# EAGLE design Circuit Diagram (EAGLE 9.3.0)
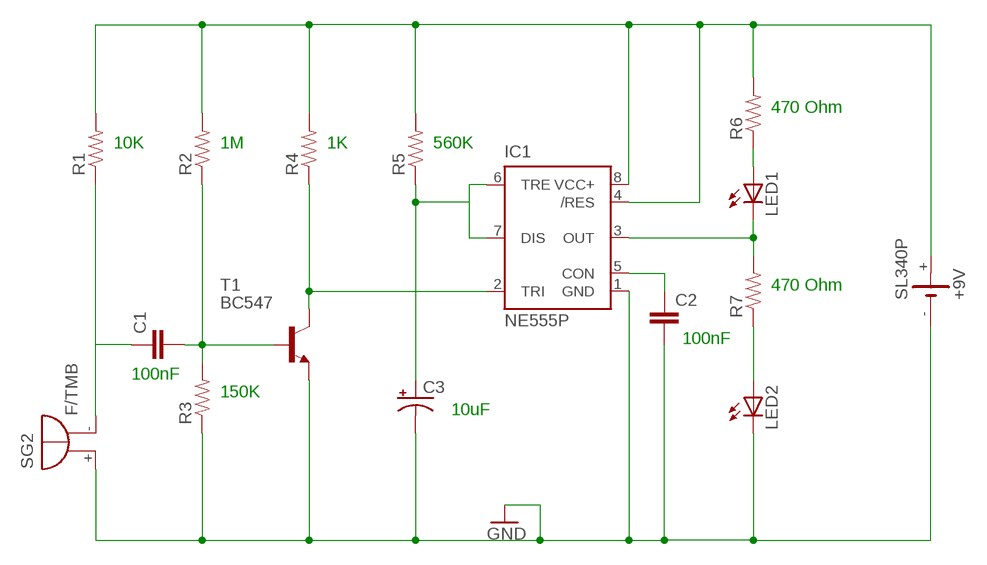
[diagram p0: schematic, sheet 1]

## Parts
+9V  SL340P  [SL-340/P3.6V]
C1  0.1UF-50V-20%(PTH)KIT-EZ  [CAP-PTH-SMALL-KIT]
C2  0.1UF-50V-20%(PTH)KIT-EZ  [CAP-PTH-SMALL-KIT]
C3  CAP_POLPTH1  [CPOL-RADIAL-100UF-25V]
IC1  NE555P  [DIL-08]
LED1  LED5MM  [LED5MM]
LED2  LED5MM  [LED5MM]
R1  10KOHM1/6W5%(PTH)KIT  [AXIAL-0.3-KIT]
R2  10KOHM1/6W5%(PTH)KIT  [AXIAL-0.3-KIT]
R3  10KOHM1/6W5%(PTH)KIT  [AXIAL-0.3-KIT]
R4  10KOHM1/6W5%(PTH)KIT  [AXIAL-0.3-KIT]
R5  10KOHM1/6W5%(PTH)KIT  [AXIAL-0.3-KIT]
R6  10KOHM1/6W5%(PTH)KIT  [AXIAL-0.3-KIT]
R7  10KOHM1/6W5%(PTH)KIT  [AXIAL-0.3-KIT]
SG2  F/TMB  [F/TMB]
T1  BC547  [TO92]

## Nets
GND: +9V.- C2.2 C3.2(-) IC1.1(GND) LED2.K(C) R3.P$1 SG2.+ T1.1(E)
N$1: C1.1 R1.P$1 SG2.-
N$2: C1.2 R2.P$1 R3.P$2 T1.2(B)
N$3: IC1.2(TRI) R4.P$1 T1.3(C)
N$4: C3.1(+) IC1.6(TRE) IC1.7(DIS) R5.P$1
N$5: C2.1 IC1.5(CON)
N$6: IC1.3(OUT) LED1.K(C) R7.P$2
N$7: LED2.A R7.P$1
N$8: +9V.+ IC1.4(/RES) IC1.8(VCC+) R1.P$2 R2.P$2 R4.P$2 R5.P$2 R6.P$2
N$9: LED1.A R6.P$1

## Notes on the sheet
- 470 Ohm
- 10K | 1M | 1K | 560K
- 470 Ohm
- 100nF
- 100nF
- 150K
- 10uF

## Library data of the parts
+9V = battery:SL340P: LI BATTERY Sonnenschein SL-340 P 3.6 V
C1 C2 = SparkFun-Capacitors:0.1UF-50V-20%(PTH): CAP-08370; PROD_ID: CAP-08370
C3 = SparkFun-Capacitors:CAP_POL: Capacitor Polarized These are standard SMD and PTH capacitors. Normally 10uF, 47uF, and 100uF in electrolytic and tantalum varieties. Always verify the external diameter of the through hole cap, it varies with capacity, voltage, and manufacturer. The EIA devices should be standard.
IC1 = SparkFun-AnalogIC:NE555: General purpose bipolar Timer; MF: Arrow Electronics; MPN: NE555N; OC_FARNELL: 1467742; OC_NEWARK: 89K1486
LED1 LED2 = SparkFun-LED:LED: LEDs Standard schematic elements and footprints for 5mm, 3mm, 1206, and 0603 sized LEDs. 5mm - Spark Fun Electronics SKU : COM-00529 (and others)
R1-R7 = SparkFun-Resistors:10KOHM1/6W5%(PTH): RES-08375; PROD_ID: RES-08375
SG2 = buzzer:F/TMB: BUZZER Source: Buerklin; OC_FARNELL: unknown; OC_NEWARK: unknown
T1 = transistor:BC547: NPN TRANSISTOR

## Board
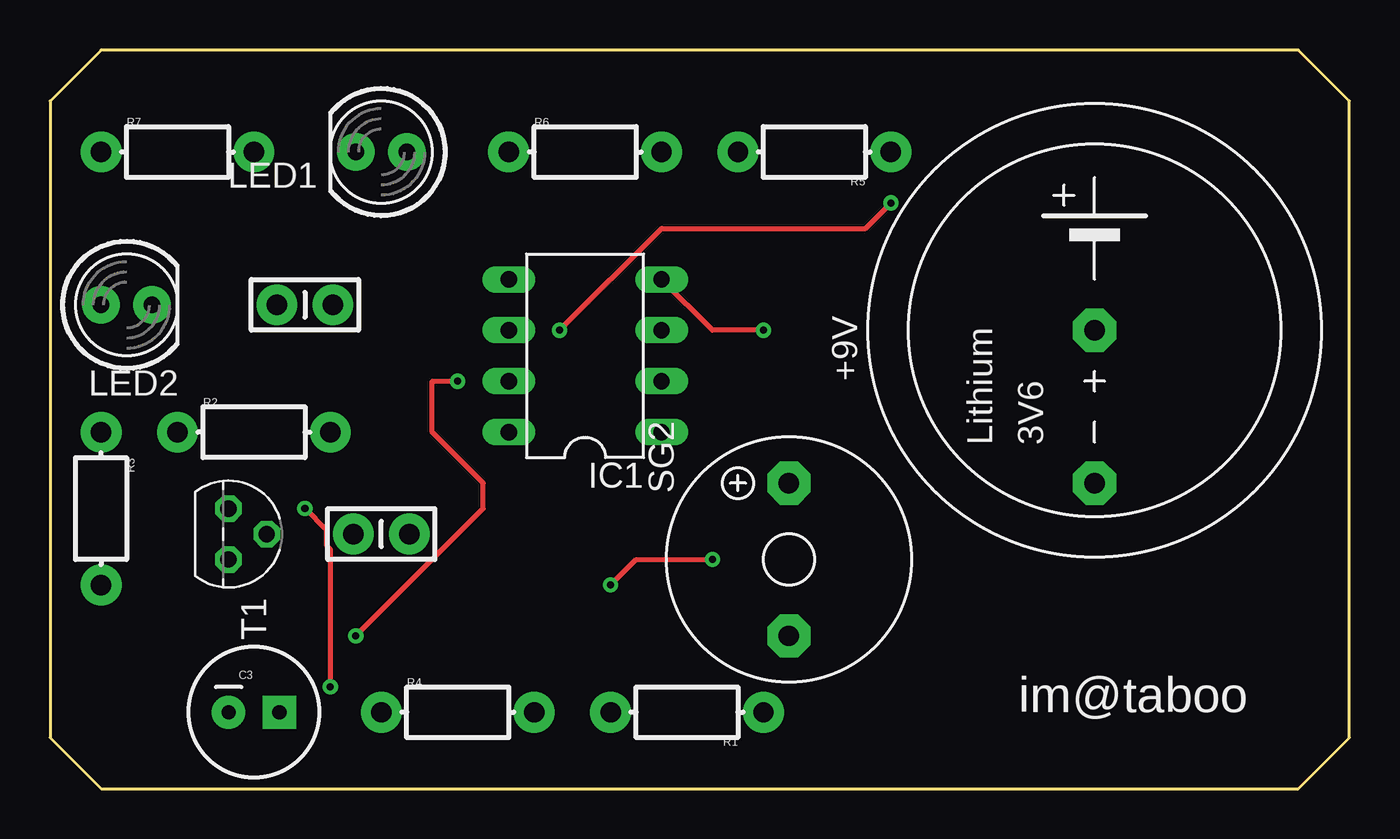
[diagram p1: board, top side]
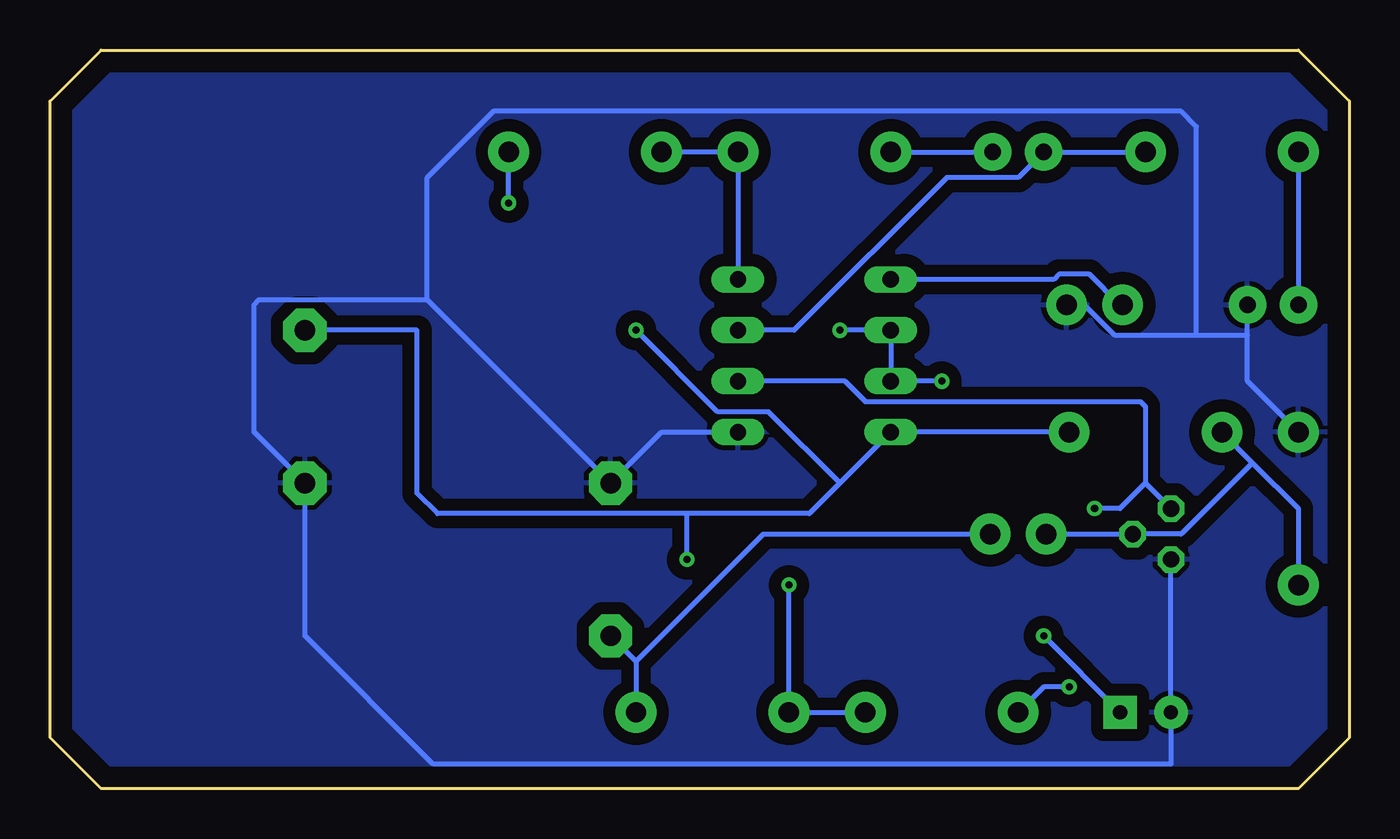
[diagram p2: board, bottom side, seen from below]

Size 64.77 x 36.83 mm. Coordinates in mm from the lower left corner, seen from the top.
Outline: 0,34.29 0,2.54 2.54,0 62.23,0 64.77,2.54 64.77,34.29 62.23,36.83 2.54,36.83 0,34.29
Copper layers (1*16): Top 0.035mm / dielectric 1.5mm / Bottom 0.035mm
Design rules "default *": minimum track width 10mil, minimum drill 0.35mm, track to track 10mil, track to pad 8mil, pad to pad 6mil, via to via 6mil, smd to smd 6mil, copper to edge 40mil, drill to drill 6mil, minimum pad ring 10mil, minimum via ring 8mil, stop-mask expansion 4mil, vias tented up to drill 0mil, thermal gap 10mil

### Footprints (pad centres in the part's own frame; a part is rotated, then mirrored left to right if it is on the bottom)
SL-340/P3.6V = drill 1.016 pad 2.159 octagon: + 0,0; - -7.62,0
CAP-PTH-SMALL-KIT = drill 1.016 pad 2.032: 1 -1.397,0; 2 1.397,0
CPOL-RADIAL-100UF-25V = drill 0.7 pad 1.651 square: 1 1.27,0 | drill 0.7 pad 1.651: 2 -1.27,0
DIL-08 = drill 0.813 long: 1 -3.81,-3.81; 2 -1.27,-3.81; 3 1.27,-3.81; 4 3.81,-3.81; 5 3.81,3.81; 6 1.27,3.81; 7 -1.27,3.81; 8 -3.81,3.81
LED5MM = drill 0.813 pad 1.88: A -1.27,0; K 1.27,0
AXIAL-0.3-KIT = drill 1.016 pad 2.032: P$1 -3.81,0; P$2 3.81,0
F/TMB = drill 1.016 pad 2.159 octagon: + 3.81,0; - -3.81,0
TO92 = drill 0.813 octagon: 1 1.27,0; 2 0,1.905; 3 -1.27,0

### Placement (x,y rotation side)
+9V  52.07,22.86 90 top
C1  16.51,12.7 180 top
C2  12.7,24.13 0 top
C3  10.16,3.81 0 top
IC1  26.67,21.59 90 top
LED1  16.51,31.75 180 top
LED2  3.81,24.13 0 top
R1  31.75,3.81 180 top
R2  10.16,17.78 0 top
R3  2.54,13.97 270 top
R4  20.32,3.81 0 top
R5  38.1,31.75 180 top
R6  26.67,31.75 0 top
R7  6.35,31.75 0 top
SG2  36.83,11.43 90 top
T1  8.89,12.7 270 top

### Tracks (layer width: path | path; a pad name or v marks a point on that pad's centre or on a via)
GND
  Bottom 0.254: 5.08,22.61 5.08,20.32 R3.P$1 | 5.08,22.61 LED2.K | C2.2 13.21,24.13 11.68,22.61 7.62,22.61 | 5.08,22.61 7.62,22.61 | T1.1 C3.2 8.89,1.22 45.67,1.22 52.07,7.62 +9V.- 54.61,17.78 54.61,24.13 54.36,24.38 45.97,24.38 | IC1.1 34.29,17.78 SG2.+ 45.97,24.38 | 45.97,24.38 45.97,30.48 42.67,33.78 8.38,33.78 7.62,33.02 7.62,22.61
  pour Bottom (isolate 0.61): 2.54,36.83 0,34.29 0,2.54 2.54,0 62.23,0 64.77,2.54 64.77,34.29 62.23,36.83
N$1
  Bottom 0.254: 35.56,6.35 R1.P$1 | SG2.- 35.56,6.35 | C1.1 29.21,12.7 35.56,6.35
N$2
  Bottom 0.254: C1.2 T1.2 8.38,12.7 4.83,16.26 | R3.P$2 2.54,13.97 4.83,16.26 | R2.P$1 4.83,16.26
N$3  (via drill 0.35)
  Top 0.254: v12.7,13.97 13.77,12.9 13.77,12.14 13.97,11.94 v13.97,5.08
  Bottom 0.254: IC1.2 25.15,20.32 24.13,19.3 10.41,19.3 10.16,19.05 10.16,15.24 | 10.16,15.24 11.43,13.97 v12.7,13.97 | T1.3 10.16,15.24 | v13.97,5.08 15.24,5.08 R4.P$1
N$4  (via drill 0.35)
  Top 0.254: v15.24,7.62 21.59,13.97 21.59,15.24 19.05,17.78 19.05,20.32 v20.32,20.32 | v25.4,22.86 30.48,27.94 40.64,27.94 v41.91,29.21
  Bottom 0.254: C3.1 v15.24,7.62 | v20.32,20.32 IC1.7 IC1.6 v25.4,22.86 | v41.91,29.21 R5.P$1
N$5
  Bottom 0.254: IC1.5 14.73,25.4 14.48,25.65 12.95,25.65 11.43,24.13 C2.1
N$6
  Bottom 0.254: IC1.3 27.69,22.86 20.07,30.48 16.51,30.48 LED1.K R7.P$2
N$7
  Bottom 0.254: R7.P$1 LED2.A
N$8  (via drill 0.35)
  Top 0.254: v35.56,22.86 33.02,22.86 IC1.4 | v27.94,10.16 29.21,11.43 v33.02,11.43
  Bottom 0.254: IC1.4 R6.P$2 R5.P$2 | R4.P$2 R1.P$2 v27.94,10.16 | R2.P$2 IC1.8 25.4,15.24 | +9V.+ 46.48,22.86 46.48,14.73 45.47,13.72 33.02,13.72 | 33.02,13.72 26.92,13.72 25.4,15.24 | 25.4,15.24 28.96,18.8 31.5,18.8 v35.56,22.86 | v33.02,11.43 33.02,13.72
N$9
  Bottom 0.254: R6.P$1 LED1.A

### Text on the board
tPlace: im@taboo